# EAGLE schematic board_v3 (EAGLE 9.2.0)
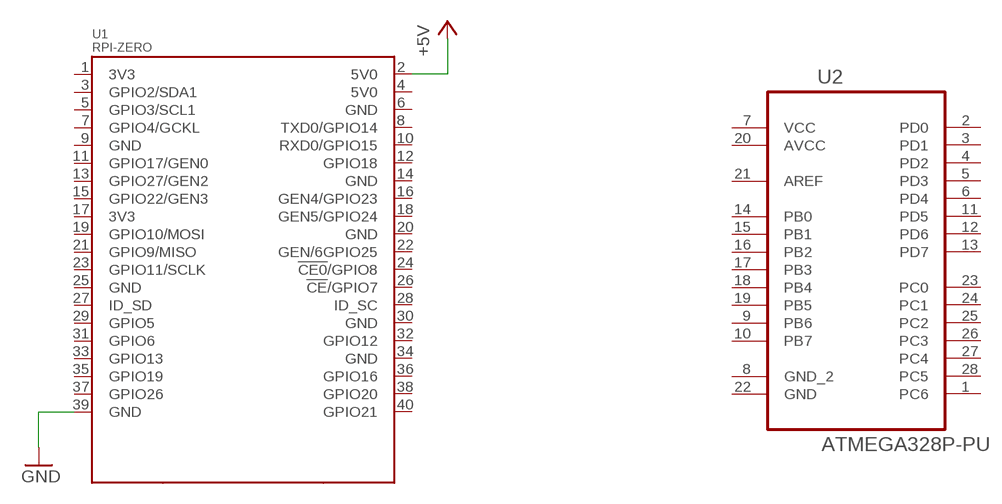
[diagram p0: schematic, sheet 1]

## Parts
U1  RPI-ZERO  [RASPBERRYPI_BASTELSTUBE_V13_RASPI_BOARD_B+_FULL]
U2  ATMEGA328P-PU  [DIP254P762X457-28]

## Nets
+5V: U1.2(5V0)
GND: U1.39(GND)
Unconnected: U1.1(3V3) U1.3(GPIO2/SDA1) U1.4(5V0) U1.5(GPIO3/SCL1) U1.6(GND) U1.7(GPIO4/GCKL) U1.8(TXD0/GPIO14) U1.9(GND) U1.10(RXD0/GPIO15) U1.11(GPIO17/GEN0) U1.12(GPIO18) U1.13(GPIO27/GEN2) U1.14(GND) U1.15(GPIO22/GEN3) U1.16(GEN4/GPIO23) U1.17(3V3) U1.18(GEN5/GPIO24) U1.19(GPIO10/MOSI) U1.20(GND) U1.21(GPIO9/MISO) U1.22(GEN/6GPIO25) U1.23(GPIO11/SCLK) U1.24(!CE0!/GPIO8) U1.25(GND) U1.26(!CE!/GPIO7) U1.27(ID_SD) U1.28(ID_SC) U1.29(GPIO5) U1.30(GND) U1.31(GPIO6) U1.32(GPIO12) U1.33(GPIO13) U1.34(GND) U1.35(GPIO19) U1.36(GPIO16) U1.37(GPIO26) U1.38(GPIO20) U1.40(GPIO21) U2.1(PC6) U2.2(PD0) U2.3(PD1) U2.4(PD2) U2.5(PD3) U2.6(PD4) U2.8(GND_2) U2.9(PB6) U2.10(PB7) U2.11(PD5) U2.12(PD6) U2.13(PD7) U2.14(PB0) U2.15(PB1) U2.16(PB2) U2.17(PB3) U2.18(PB4) U2.19(PB5) U2.21(AREF) U2.22(GND) U2.23(PC0) U2.24(PC1) U2.25(PC2) U2.26(PC3) U2.27(PC4) U2.28(PC5)

## Power pins joined to a net without a drawn wire
AVCC: U2.20(AVCC)
VCC: U2.7(VCC)

## Library data of the parts
U1 = RPI-Zero:RPI-ZERO
U2 = Atmel_By_element14_Batch_1-00:ATMEGA328P-PU: 8-bit Microcontroller with In-System Programmable Flash; MPN: ATMEGA328P-PU; OC_FARNELL: 1715487; OC_NEWARK: 15R0268; PACKAGE: PDIP-28; SUPPLIER: Atmel